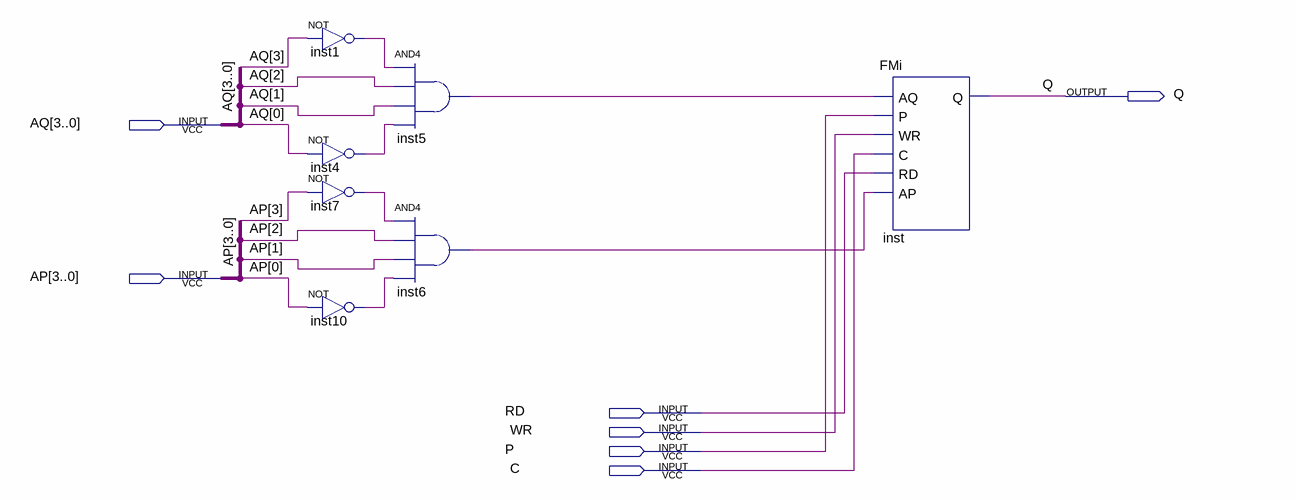
[diagram p0: schematic sheet]
// Quartus schematic FM0110.bdf as structural Verilog: 7 symbols, 7 pins
module FM0110 (
  input  [3:0] AQ,
  input  [3:0] AP,
  input  RD,
  input  WR,
  input  P,
  input  C,
  output Q
);

  wire inst1_out, inst4_out, inst5_out, inst6_out, inst7_out, inst10_out;

  not inst1 (inst1_out, AQ[3]);
  not inst4 (inst4_out, AQ[0]);
  not inst7 (inst7_out, AP[3]);
  not inst10 (inst10_out, AP[0]);
  and inst5 (inst5_out, inst1_out, AQ[2], AQ[1], inst4_out);
  and inst6 (inst6_out, inst7_out, AP[2], AP[1], inst10_out);
  FMi inst (.AQ(inst5_out), .P(P), .WR(WR), .C(C), .RD(RD), .AP(inst6_out), .Q(Q));
endmodule
